# EasyEDA Pro project PBMCU_C_Hall.epro, schematic Schematic1_1
Board Name: 组件板; Create Date: 2024-12-15; Page Name: P1; Project Name: BMCU-V0.6; Schematic Name: Schematic1_1; Update Date: 2025-03-16; Company: 嘉立创EDA; Page Size: A4; Version: V1.0
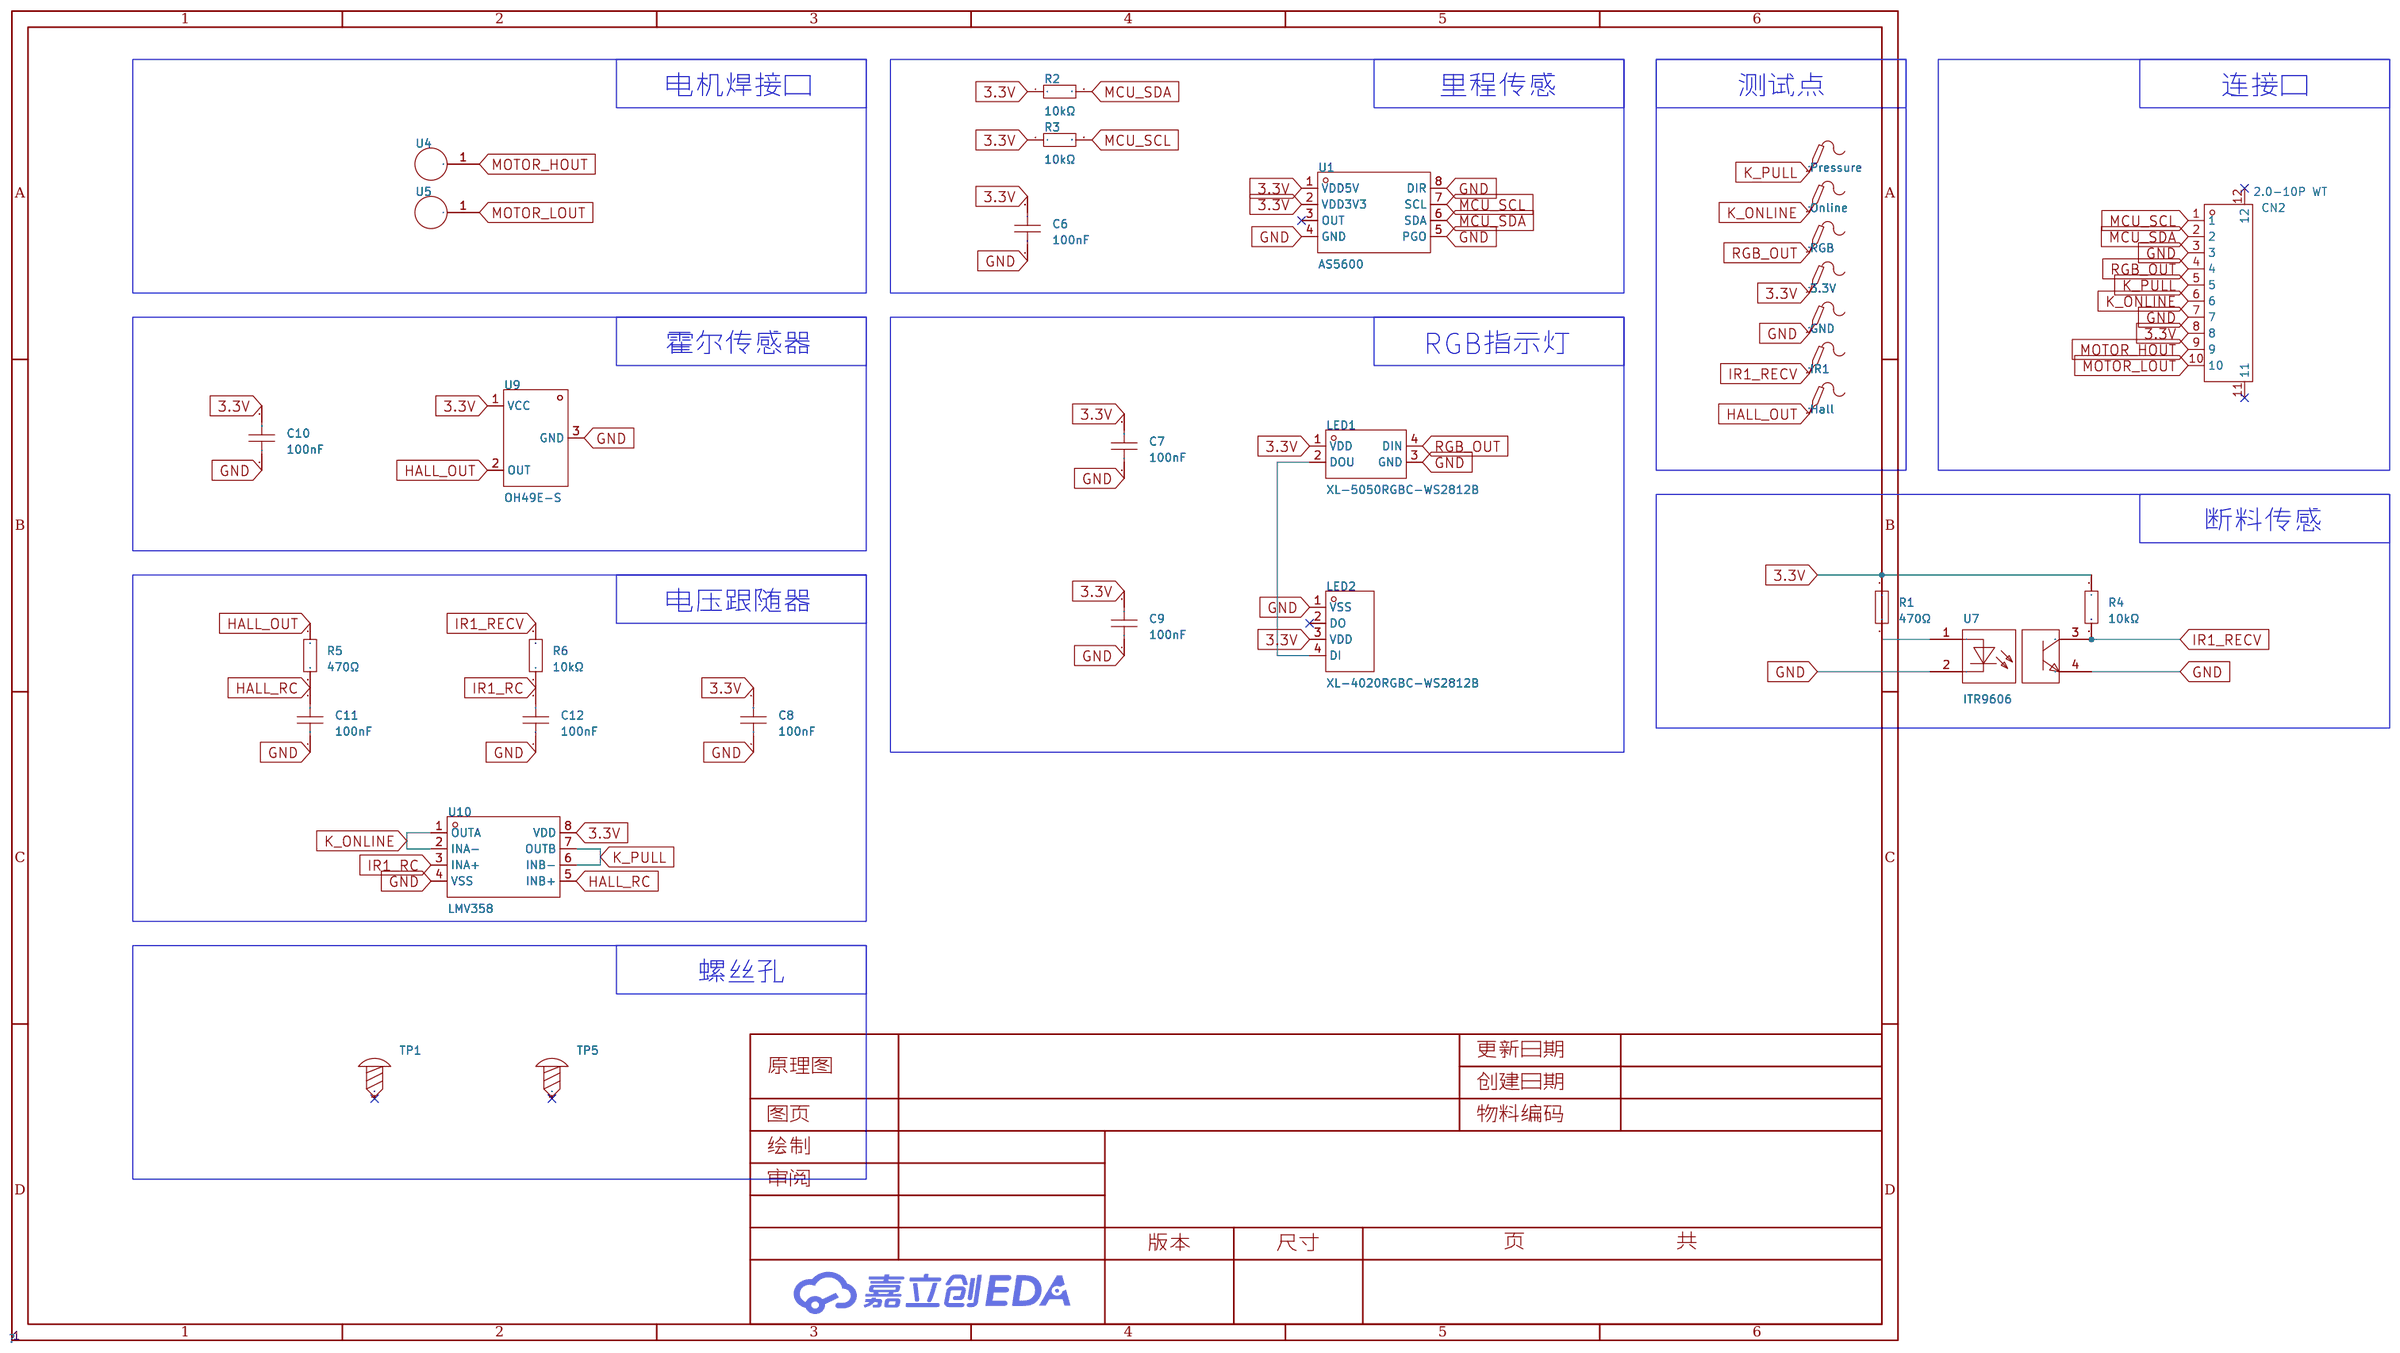
[diagram p1: schematic sheet]

## Parts
3.3V  -  [Test-Point-0.5mm]
C6  100nF  [C0603]
C7  100nF  [C0603]
C8  100nF  [C0603]
C9  100nF  [C0603]
C10  100nF  [C0603]
C11  100nF  [C0603]
C12  100nF  [C0603]
CN2  2.0-10P WT  [CONN-SMD_10P-P2.00_2.0-10P-WT]
GND  -  [Test-Point-0.5mm]
Hall  -  [Test-Point-0.5mm]
IR1  -  [Test-Point-0.5mm]
LED1  XL-5050RGBC-WS2812B  [LED-SMD_4P-L5.0-W5.0-BL_XL-5050RGBC]
LED2  XL-4020RGBC-WS2812B  [LED-SMD_4P-L4.0-W1.7_XL-4020RGBC-WS2812B]
Online  -  [Test-Point-0.5mm]
Pressure  -  [Test-Point-0.5mm]
R1  470Ω  [R0603]
R2  10kΩ  [R0603]
R3  10kΩ  [R0603]
R4  10kΩ  [R0603]
R5  470Ω  [R0603]
R6  10kΩ  [R0603]
RGB  -  [Test-Point-0.5mm]
TP1  -  [M2螺丝]
TP5  -  [M2螺丝]
U1  AS5600  [SOIC-8_L4.9-W3.9-P1.27-LS6.0-BL]
U4  1625854-2  [TEST-RING]
U5  1625854-2  [TEST-RING]
U7  ITR9606  [OPTO-TH_4P_ITR9606]
U9  OH49E-S  [SOT-23-3_L2.9-W1.6-P1.90-LS2.8-BR]
U10  LMV358  [SOP-8_L4.9-W3.9-P1.27-LS6.0-BL]

## Library data of the parts
3.3V GND Hall IR1 Online Pressure RGB = Test-Point: Test Point 测试点
C6-C12 = CC0603KRX7R9BB104: 容值:100nF;精度:±10%;额定电压:50V;材质(温度系数):X7R;; LCSC Part Name: 100nF ±10% 50V; Supplier Part: C14663; Manufacturer: YAGEO(国巨); Supplier Footprint: 0603; JLCPCB Part Class: Basic Part; Datasheet: https://atta.szlcsc.com/upload/public/pdf/source/20180910/C282072_33301C7F631E79921B82A8DAC6BCC5B3.pdf; Supplier: LCSC; Tolerance: ±10%; Voltage Rated: 50V; Temperature Coefficient: X7R
CN2 = 2.0-10P WT: 插针结构:1x10P;间距:2mm;安装方式:卧贴;参考系列:PH;总PIN数:10P;排数:1;每排PIN数:10;额定电流:2A;工作温度范围:-25℃~+85℃;; LCSC Part Name: 间距:2mm 1x10P 卧贴; Supplier Part: C5340818; Manufacturer: SHOU HAN(首韩); Supplier Footprint: SMD,P=2mm,卧贴; Datasheet: https://atta.szlcsc.com/upload/public/pdf/source/20221228/2B469FB976A3BE7FA48F92FFEBDB46D7.pdf; Supplier: LCSC; Pins Structure: 1x10P; Pitch: 2mm; Mounting Style: 卧贴; Reference Series: PH; Number of Pins: 10P; Number of Rows: 1; Number of PINs Per Row: 10; Current Rating (Max): 2A; Operating Temperature Range: -25℃~+85℃
LED1 = XL-5050RGBC-WS2812B: 5050七彩幻彩透明贴片LED灯珠 5050 幻彩透明四脚 ws2812B 内置驱动IC; Supplier Part: C2843785; Manufacturer: XINGLIGHT(成兴光); Supplier Footprint: SMD5050; Datasheet: https://atta.szlcsc.com/upload/public/pdf/source/20240412/E1004CAA80592E31D08BFE019083806F.pdf; Supplier: LCSC
LED2 = XL-4020RGBC-WS2812B: 4020幻彩 4侧贴式幻彩灯珠 ws2812B 内置驱动IC; Supplier Part: C3647024; Manufacturer: XINGLIGHT(成兴光); Supplier Footprint: SMD,2x4mm; JLCPCB Part Class: 扩展库; Datasheet: https://atta.szlcsc.com/upload/public/pdf/source/20240229/191D5186283B54A17967D79876487C73.pdf; Supplier: LCSC
R1 R5 = 0603WAF4700T5E: 电阻类型:厚膜电阻;阻值:470Ω;精度:±1%;功率:100mW;最大工作电压:75V;温度系数:±100ppm/℃;; LCSC Part Name: 470Ω ±1% 100mW 厚膜电阻; Supplier Part: C23179; Manufacturer: UNI-ROYAL(厚声); Supplier Footprint: 0603; Datasheet: https://atta.szlcsc.com/upload/public/pdf/source/20200306/C422600_1E6D84923E4A46A82E41ADD87F860B5C.pdf; Supplier: LCSC; Type: 厚膜电阻; Tolerance: ±1%; Power(Watts): 100mW; Overload Voltage (Max): 75V; Temperature Coefficient: ±100ppm/℃; Operating Temperature Range: -55℃~+155℃
R2-R4 R6 = 0603WAF1002T5E: 电阻类型:厚膜电阻;阻值:10kΩ;精度:±1%;功率:100mW;最大工作电压:75V;温度系数:±100ppm/℃;; LCSC Part Name: 厚膜电阻 10kΩ ±1% 100mW; Supplier Part: C25804; Manufacturer: UNI-ROYAL(厚声); Supplier Footprint: 0603; JLCPCB Part Class: 基础库; Datasheet: https://atta.szlcsc.com/upload/public/pdf/source/20200306/C422600_1E6D84923E4A46A82E41ADD87F860B5C.pdf; Supplier: LCSC; Type: 厚膜电阻; Tolerance: ±1%; Power(Watts): 100mW; Overload Voltage (Max): 75V; Temperature Coefficient: ±100ppm/℃; Operating Temperature Range: -55℃~+155℃
TP1 TP5 = M2螺丝: Supplier Footprint: 插件
U1 = AS5600: Supplier Part: C9900021040; Supplier Footprint: SOIC-8; Supplier: LCSC
U4 U5 = 1625854-2: PC 测试点 表面贴装; Supplier Part: C306063; Manufacturer: TE Connectivity(泰科电子); JLCPCB Part Class: 扩展库; Datasheet: https://atta.szlcsc.com/upload/public/pdf/source/20221209/97BE41A51F1CE3ECBA7573F39B62A732.pdf; Supplier: LCSC
U7 = ITR9606: LCSC Part Name: 5mm 光中断器; Supplier Part: C264271; Manufacturer: EVERLIGHT(亿光); Supplier Footprint: DIP-4; Datasheet: https://atta.szlcsc.com/upload/public/pdf/source/20180817/C264271_0A5A08AFBE67158755A762373070CED7.pdf; Supplier: LCSC
U9 = OH49E-S: LCSC Part Name: 线性霍尔开关电路; Supplier Part: C85573; Manufacturer: 南京欧卓; Supplier Footprint: SOT-23; JLCPCB Part Class: 扩展库; Datasheet: https://atta.szlcsc.com/upload/public/pdf/source/20170824/C85573_1503566162060907583.pdf; Supplier: LCSC
U10 = LMV358: 轨到轨:轨到轨输入,轨到轨输出;增益带宽积(GBP):1MHz;输入失调电压(Vos):5mV;压摆率(SR):0.6V/us;; Supplier Part: C2923376; Manufacturer: TECH PUBLIC(台舟); Supplier Footprint: SOP-8; Datasheet: https://atta.szlcsc.com/upload/public/pdf/source/20211125/73A2622E62D548ADC8514436842F6162.pdf; Supplier: LCSC; Maximum Power Supply Range (Vdd-Vss): 5.5V; Rail to Rail: 轨到轨输入,轨到轨输出; Gain Bandwidth Product(GBP): 1MHz; Voltage - Input Offset(Vos): 5mV; Input Offset Voltage Drift (Vos TC): 2uV/℃; Slew Rate(SR): 0.6V/us; Noise density(eN): 20nV/√Hz@10kHz; Common Mode Rejection Ratio (CMRR): 65dB

## Nets
3.3V: 3.3V.1 C6.2 C7.2 C8.2 C9.2 C10.2 CN2.8 LED1.1(VDD) LED2.3(VDD) R1.1 R2.1 R3.1 R4.1 U1.1(VDD5V) U1.2(VDD3V3) U9.1(VCC) U10.8(VDD)
GND: C6.1 C7.1 C8.1 C9.1 C10.1 C11.1 C12.1 CN2.3 CN2.7 GND.1 LED1.3(GND) LED2.1(VSS) U1.4(GND) U1.5(PGO) U1.8(DIR) U7.2 U7.4 U9.3(GND) U10.4(VSS)
HALL_OUT: Hall.1 R5.1 U9.2(OUT)
HALL_RC: C11.2 R5.2 U10.5(INB+)
IR1_RC: C12.2 R6.1 U10.3(INA+)
IR1_RECV: IR1.1 R4.2 R6.2 U7.3
K_ONLINE: CN2.6 Online.1 U10.1(OUTA) U10.2(INA-)
K_PULL: CN2.5 Pressure.1 U10.6(INB-) U10.7(OUTB)
MCU_SCL: CN2.1 R3.2 U1.7(SCL)
MCU_SDA: CN2.2 R2.2 U1.6(SDA)
MOTOR_HOUT: CN2.9 U4.1
MOTOR_LOUT: CN2.10 U5.1
RGB_OUT: CN2.4 LED1.4(DIN) RGB.1
$1N10852: LED1.2(DOU) LED2.4(DI)
$1N13047: R1.2 U7.1

Not connected (* = marked no-connect by the designer): CN2 11* 12*; LED2 2(DO)*; TP1 1*; TP5 1*; U1 3(OUT)*

## Notes on the sheet
- 电机焊接口
- 里程传感
- 测试点
- 连接口
- 霍尔传感器
- RGB指示灯
- 断料传感
- 电压跟随器
- 螺丝孔
